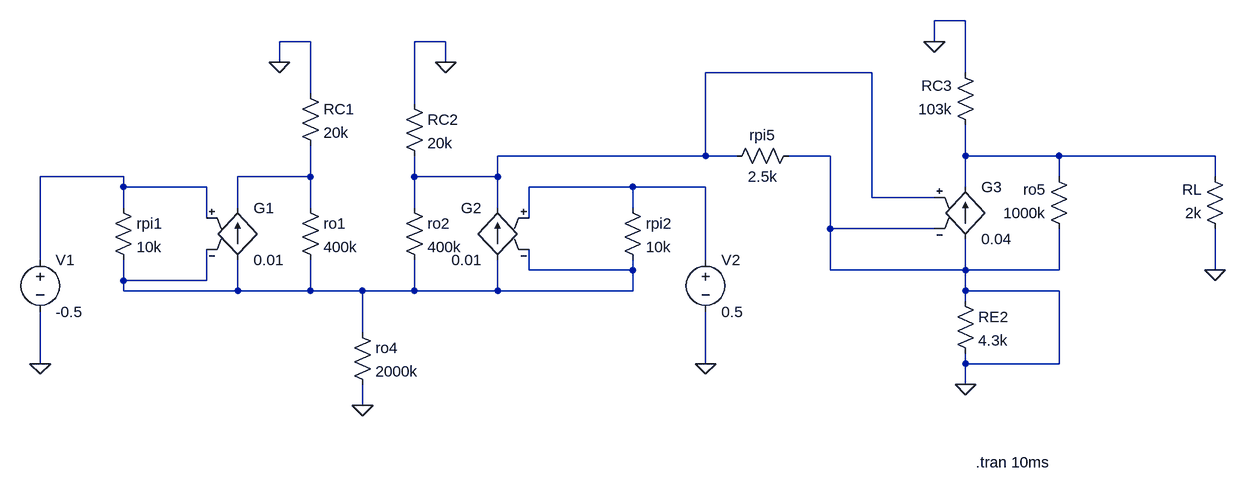
[diagram p0: schematic small signal model.asc]
small signal model.asc, the LTspice schematic file:
Version 4
SHEET 1 1908 960
WIRE 1504 0 1456 0
WIRE 496 32 448 32
WIRE 704 32 656 32
WIRE 1456 32 1456 0
WIRE 448 64 448 32
WIRE 704 64 704 32
WIRE 1360 80 1104 80
WIRE 1504 80 1504 0
WIRE 496 112 496 32
WIRE 656 128 656 32
WIRE 1104 208 1104 80
WIRE 1104 208 784 208
WIRE 1152 208 1104 208
WIRE 1296 208 1232 208
WIRE 1504 208 1504 160
WIRE 1648 208 1504 208
WIRE 1888 208 1648 208
WIRE 208 240 80 240
WIRE 496 240 496 192
WIRE 496 240 384 240
WIRE 656 240 656 208
WIRE 784 240 784 208
WIRE 784 240 656 240
WIRE 1648 240 1648 208
WIRE 1888 240 1888 208
WIRE 208 256 208 240
WIRE 336 256 208 256
WIRE 992 256 832 256
WIRE 1104 256 992 256
WIRE 1504 256 1504 208
WIRE 1360 272 1360 80
WIRE 1456 272 1360 272
WIRE 208 288 208 256
WIRE 384 288 384 240
WIRE 496 288 496 240
WIRE 656 288 656 240
WIRE 784 288 784 240
WIRE 992 288 992 256
WIRE 336 304 336 256
WIRE 832 304 832 256
WIRE 1296 320 1296 208
WIRE 1456 320 1296 320
WIRE 80 368 80 240
WIRE 1104 368 1104 256
WIRE 832 384 832 352
WIRE 992 384 992 368
WIRE 992 384 832 384
WIRE 1296 384 1296 320
WIRE 1504 384 1504 336
WIRE 1504 384 1296 384
WIRE 1648 384 1648 320
WIRE 1648 384 1504 384
WIRE 1888 384 1888 320
WIRE 208 400 208 368
WIRE 336 400 336 352
WIRE 336 400 208 400
WIRE 208 416 208 400
WIRE 384 416 384 368
WIRE 384 416 208 416
WIRE 496 416 496 368
WIRE 496 416 384 416
WIRE 576 416 496 416
WIRE 656 416 656 368
WIRE 656 416 576 416
WIRE 784 416 784 368
WIRE 784 416 656 416
WIRE 992 416 992 384
WIRE 992 416 784 416
WIRE 1504 416 1504 384
WIRE 1648 416 1504 416
WIRE 1504 432 1504 416
WIRE 576 480 576 416
WIRE 80 528 80 448
WIRE 1104 528 1104 448
WIRE 1504 528 1504 512
WIRE 1648 528 1648 416
WIRE 1648 528 1504 528
WIRE 1504 560 1504 528
WIRE 576 592 576 560
FLAG 1888 384 0
FLAG 576 592 0
FLAG 448 64 0
FLAG 704 64 0
FLAG 1456 32 0
FLAG 1504 560 0
FLAG 80 528 0
FLAG 1104 528 0
SYMBOL Res 480 96 R0
SYMATTR InstName RC1
SYMATTR Value 20k
SYMBOL Res 480 272 R0
SYMATTR InstName ro1
SYMATTR Value 400k
SYMBOL Res 192 272 R0
SYMATTR InstName rpi1
SYMATTR Value 10k
SYMBOL Res 560 464 R0
SYMATTR InstName ro4
SYMATTR Value 2000k
SYMBOL Res 640 272 R0
SYMATTR InstName ro2
SYMATTR Value 400k
SYMBOL Res 640 112 R0
SYMATTR InstName RC2
SYMATTR Value 20k
SYMBOL Res 976 272 R0
SYMATTR InstName rpi2
SYMATTR Value 10k
SYMBOL Res 1248 192 R90
WINDOW 0 0 56 VBottom 2
WINDOW 3 32 56 VTop 2
SYMATTR InstName rpi5
SYMATTR Value 2.5k
SYMBOL Res 1664 336 R180
WINDOW 0 36 76 Left 2
WINDOW 3 36 40 Left 2
SYMATTR InstName ro5
SYMATTR Value 1000k
SYMBOL Res 1904 336 R180
WINDOW 0 36 76 Left 2
WINDOW 3 36 40 Left 2
SYMATTR InstName RL
SYMATTR Value 2k
SYMBOL Res 1520 176 R180
WINDOW 0 36 76 Left 2
WINDOW 3 36 40 Left 2
SYMATTR InstName RC3
SYMATTR Value 103k
SYMBOL Res 1488 416 R0
SYMATTR InstName RE2
SYMATTR Value 4.3k
SYMBOL g 384 272 R0
SYMATTR InstName G1
SYMATTR Value 0.01
SYMBOL g 784 272 M0
SYMATTR InstName G2
SYMATTR Value 0.01
SYMBOL g 1504 240 R0
SYMATTR InstName G3
SYMATTR Value 0.04
SYMBOL Voltage 80 352 R0
SYMATTR InstName V1
SYMATTR Value -0.5
SYMBOL Voltage 1104 352 R0
SYMATTR InstName V2
SYMATTR Value 0.5
TEXT 1520 680 Left 2 !.tran 10ms

The netlist it stands for:
* small signal model.asc
RC1 0 N004 20k
ro1 N004 N006 400k
rpi1 N003 N006 10k
ro4 N006 0 2000k
ro2 N001 N006 400k
RC2 0 N001 20k
rpi2 N005 N006 10k
rpi5 0 N001 2.5k
ro5 0 N002 1000k
RL 0 N002 2k
RC3 N002 0 103k
RE2 0 0 4.3k
G1 N006 N004 N003 N006 0.01
G2 N006 N001 N005 N006 0.01
G3 0 N002 N001 0 0.04
V1 N003 0 -0.5
V2 N005 0 0.5
.tran 10ms
.backanno
.end